# Altium schematic sheet Power.SchDoc
size Letter
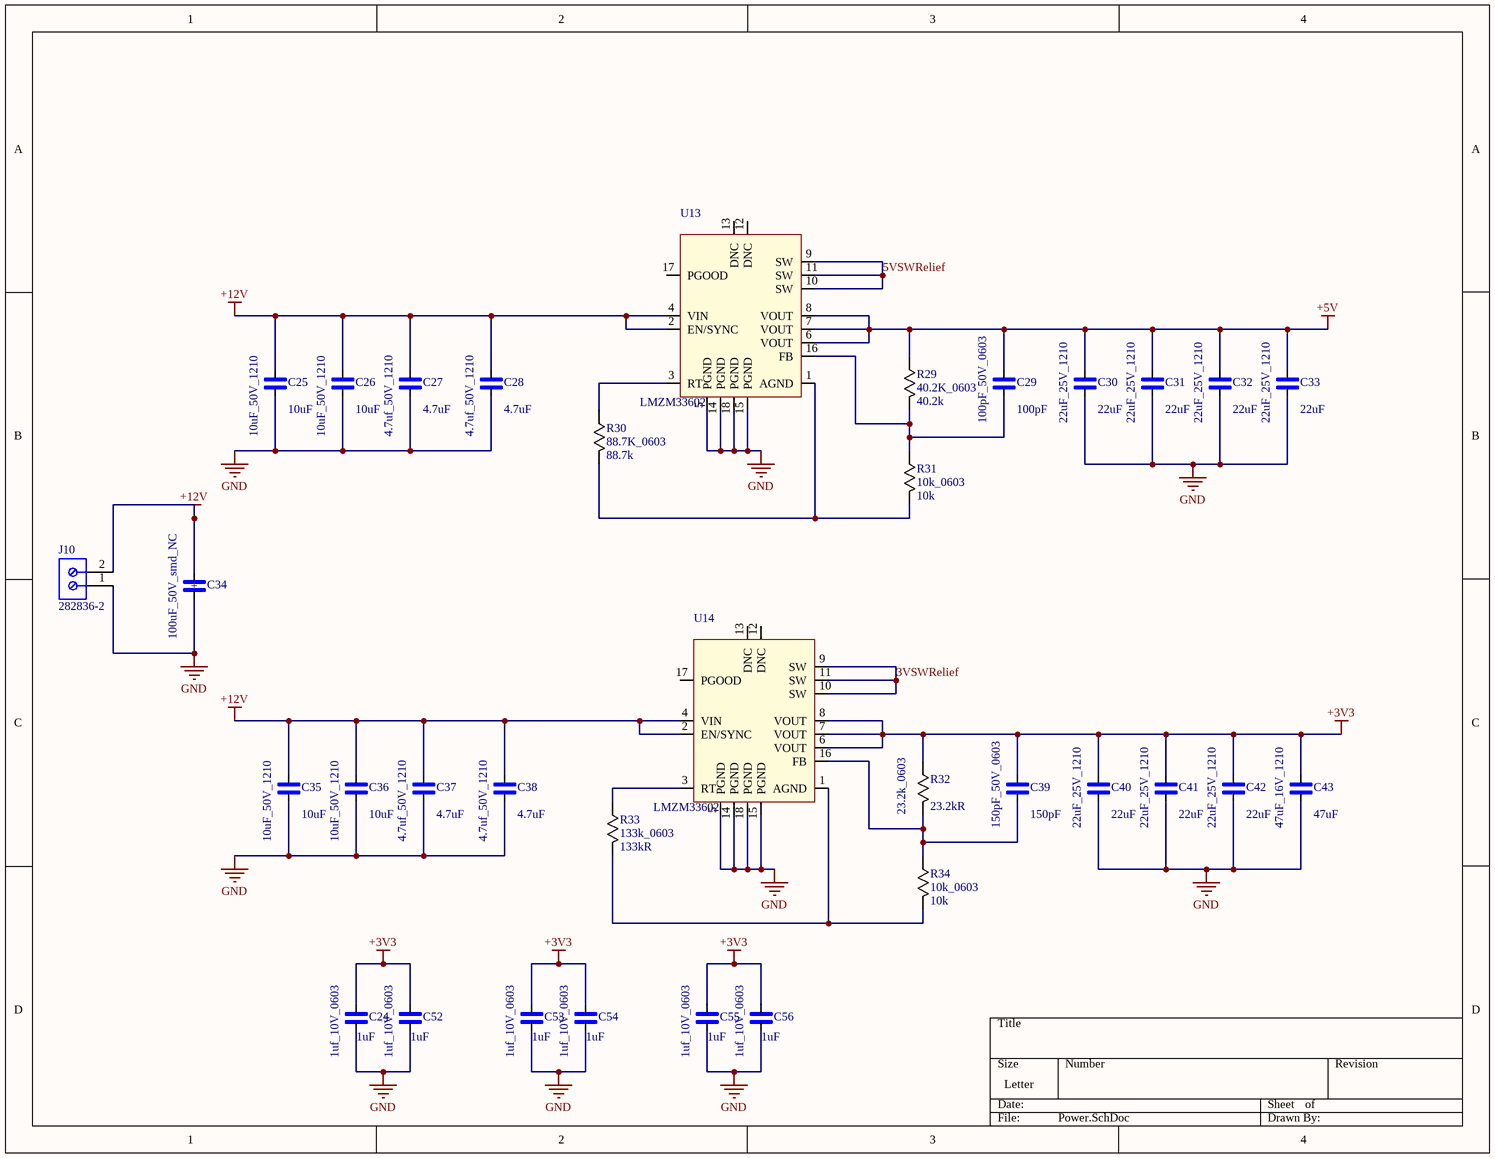
[diagram p0: Power.SchDoc]

## Parts
C24  1uf_10V_0603  Capacitance: 1uF  [0603]
C25  10uF_50V_1210  Capacitance: 10uF  [1210]
C26  10uF_50V_1210  Capacitance: 10uF  [1210]
C27  4.7uf_50V_1210  Capacitance: 4.7uF  [1210]
C28  4.7uf_50V_1210  Capacitance: 4.7uF  [1210]
C29  100pF_50V_0603  Capacitance: 100pF  [0603]
C30  22uF_25V_1210  Capacitance: 22uF  [1210]
C31  22uF_25V_1210  Capacitance: 22uF  [1210]
C32  22uF_25V_1210  Capacitance: 22uF  [1210]
C33  22uF_25V_1210  Capacitance: 22uF  [1210]
C34  100uF_50V_smd_NC  [CAPAE120103X105M]
C35  10uF_50V_1210  Capacitance: 10uF  [1210]
C36  10uF_50V_1210  Capacitance: 10uF  [1210]
C37  4.7uf_50V_1210  Capacitance: 4.7uF  [1210]
C38  4.7uf_50V_1210  Capacitance: 4.7uF  [1210]
C39  150pF_50V_0603  Capacitance: 150pF  [0603]
C40  22uF_25V_1210  Capacitance: 22uF  [1210]
C41  22uF_25V_1210  Capacitance: 22uF  [1210]
C42  22uF_25V_1210  Capacitance: 22uF  [1210]
C43  47uF_16V_1210  Capacitance: 47uF  [1210]
C52  1uf_10V_0603  Capacitance: 1uF  [0603]
C53  1uf_10V_0603  Capacitance: 1uF  [0603]
C54  1uf_10V_0603  Capacitance: 1uF  [0603]
C55  1uf_10V_0603  Capacitance: 1uF  [0603]
C56  1uf_10V_0603  Capacitance: 1uF  [0603]
J10  282836-2  [TECO-282836-2_V]
R29  40.2K_0603  Resistance: 40.2k  [0603]
R30  88.7K_0603  Resistance: 88.7k  [0603]
R31  10k_0603  Resistance: 10k  [0603]
R32  23.2k_0603  Resistance: 23.2kR  [0603]
R33  133k_0603  Resistance: 133kR  [0603]
R34  10k_0603  Resistance: 10k  [0603]
U13  LMZM33602  [QFN50P700X900X410_HS-55N]
U14  LMZM33602  [QFN50P700X900X410_HS-55N]

## Nets
+3V3: C24.2 C39.2 C40.2 C41.2 C42.2 C43.2 C52.2 C53.2 C54.2 C55.2 C56.2 R32.2 U14.6(VOUT) U14.7(VOUT) U14.8(VOUT)
+5V: C29.2 C30.2 C31.2 C32.2 C33.2 R29.2 U13.6(VOUT) U13.7(VOUT) U13.8(VOUT)
+12V: C25.2 C26.2 C27.2 C28.2 C34.1(+) C35.2 C36.2 C37.2 C38.2 J10.2 U13.2(EN/SYNC) U13.4(VIN) U14.2(EN/SYNC) U14.4(VIN)
GND: C24.1 C25.1 C26.1 C27.1 C28.1 C30.1 C31.1 C32.1 C33.1 C34.2 C35.1 C36.1 C37.1 C38.1 C40.1 C41.1 C42.1 C43.1 C52.1 C53.1 C54.1 C55.1 C56.1 J10.1 U13.5(PGND) U13.14(PGND) U13.15(PGND) U13.18(PGND) U14.5(PGND) U14.14(PGND) U14.15(PGND) U14.18(PGND)
3VSWRelief: U14.9(SW) U14.10(SW) U14.11(SW)
5VSWRelief: U13.9(SW) U13.10(SW) U13.11(SW)
NetC29_1: C29.1 R29.1 R31.2 U13.16(FB)
NetC39_1: C39.1 R32.1 R34.2 U14.16(FB)
NetR30_1: R30.1 R31.1 U13.1(AGND)
NetR30_2: R30.2 U13.3(RT)
NetR33_1: R33.1 R34.1 U14.1(AGND)
NetR33_2: R33.2 U14.3(RT)

Not connected (* = marked no-connect by the designer): U13 12(DNC) 13(DNC) 17(PGOOD); U14 12(DNC) 13(DNC) 17(PGOOD)

## Library data of the parts
C24 C52-C56 = 1uf_10V_0603: Manufacturer: Murata; Manufacturer Part Number: GRM188R61A105KA61J; Voltage Rating: 10V; Tolerance: 10%; Dielectric: X5R; Supplier 1: Digi-Key; Stock 1: 0; Pricing 1: 30000=0.0118 (USD); Mount: Surface Mount; Case/Package: 0603; Case Code (Metric): 1608; Case Code (Imperial): 0603; Min Operating Temperature: -55°C; Max Operating Temperature: 85°C; Package Quantity: 1; Packaging: Tape and Reel; Voltage Rating (DC): 10V; Termination: SMD/SMT; Length: 1.6mm; Height: 0.8mm; Width: 0.031inch; Thickness: 0.035inch; Depth: 0.8mm; Radiation Hardening: No; REACH SVHC: No SVHC; ComponentLink1URL: https://datasheet.ciiva.com/6270/product-6270752.pdf; ComponentLink1Description: https://datasheet.ciiva.com/6270/product-6270752.pdf; ComponentLink2URL: https://datasheet.ciiva.com/6270/partnumbering-e-01-6270748.pdf; ComponentLink2Description: https://datasheet.ciiva.com/6270/partnumbering-e-01-6270748.pdf; ComponentLink3URL: https://datasheet.ciiva.com/6270/partnumbering-e-01-6270750.pdf; ComponentLink3Description: https://datasheet.ciiva.com/6270/partnumbering-e-01-6270750.pdf; Supplier Part Number 1: GRM188R61A105KA61J-ND
C25 C26 C35 C36 = 10uF_50V_1210: Manufacturer: Murata; Manufacturer Part Number: GRM32ER71H106KA12L; Material: Ceramic; Tolerance: 10%; Dielectric: X7R; Voltage Rating (DC): 50V; Supplier 1: Digi-Key; Stock 1: 0; Mount: Surface Mount; Case/Package: 1210; Case Code (Imperial): 1210; Case Code (Metric): 3225; Min Operating Temperature: -55°C; Max Operating Temperature: 125°C; Package Quantity: 1000; Packaging: Tape and Reel; Voltage Rating: 50V; Termination: SMD/SMT; Voltage: 50V; Length: 3.2mm; Height: 2.5mm; Width: 2.5mm; Thickness: 0.106inch; Depth: 2.5mm; Radiation Hardening: No; REACH SVHC: No SVHC; Lead Free: Lead Free; ComponentLink1URL: https://datasheet.ciiva.com/16497/product-16497010.pdf; ComponentLink1Description: https://datasheet.ciiva.com/16497/product-16497010.pdf; ComponentLink2URL: https://datasheet.ciiva.com/6270/partnumbering-e-01-6270167.pdf; ComponentLink2Description: https://datasheet.ciiva.com/6270/partnumbering-e-01-6270167.pdf; ComponentLink3URL: https://datasheet.ciiva.com/6270/partnumbering-e-01-6270168.pdf; ComponentLink3Description: https://datasheet.ciiva.com/6270/partnumbering-e-01-6270168.pdf; ComponentLink4URL: https://datasheet.ciiva.com/6270/partnumbering-e-01-6270169.pdf; ComponentLink4Description: https://datasheet.ciiva.com/6270/partnumbering-e-01-6270169.pdf; ComponentLink5URL: https://datasheet.ciiva.com/11789/0900766b80ef921d-11789081.pdf; ComponentLink5Description: https://datasheet.ciiva.com/11789/0900766b80ef921d-11789081.pdf; ComponentLink6URL: https://datasheet.ciiva.com/3777/4286grm32er71h106ka1223-3777306.pdf; ComponentLink6Description: https://datasheet.ciiva.com/3777/4286grm32er71h106ka1223-3777306.pdf; ComponentLink7URL: https://datasheet.ciiva.com/11607/c02e-11607596.pdf; ComponentLink7Description: https://datasheet.ciiva.com/11607/c02e-11607596.pdf; ComponentLink8URL: https://datasheet.ciiva.com/46441/1754714-46441340.pdf; ComponentLink8Description: https://datasheet.ciiva.com/46441/1754714-46441340.pdf; ComponentLink9URL: https://datasheet.ciiva.com/2989/c02e-2989823.pdf; ComponentLink9Description: https://datasheet.ciiva.com/2989/c02e-2989823.pdf; Supplier Part Number 1: GRM32ER71H106KA12L-ND
C27 C28 C37 C38 = 4.7uf_50V_1210: Manufacturer: Murata; Manufacturer Part Number: GRM32ER71H475KA88L; Tolerance: 10%; Dielectric: X7R; Voltage Rating: 50V; Supplier 1: Future Electronics; Stock 1: 0; Mount: Surface Mount; Case/Package: 1210; Number of Pins: 2; Case Code (Metric): 3225; Case Code (Imperial): 1210; Min Operating Temperature: -55°C; Max Operating Temperature: 125°C; Packaging: Tape and Reel; Package Quantity: 1; Voltage Rating (DC): 50V; Termination: SMD/SMT; Voltage: 50V; Length: 3.2mm; Height: 2.5mm; Width: 0.098inch; Thickness: 0.106inch; Depth: 2.5mm; Radiation Hardening: No; REACH SVHC: No SVHC; Lead Free: Lead Free; ComponentLink1URL: https://datasheet.ciiva.com/7937/1747494-7937780.pdf; ComponentLink1Description: https://datasheet.ciiva.com/7937/1747494-7937780.pdf; ComponentLink2URL: https://datasheet.ciiva.com/11786/0900766b806042af-11786805.pdf; ComponentLink2Description: https://datasheet.ciiva.com/11786/0900766b806042af-11786805.pdf; ComponentLink3URL: https://datasheet.ciiva.com/22703/1747494-22703399.pdf; ComponentLink3Description: https://datasheet.ciiva.com/22703/1747494-22703399.pdf; ComponentLink4URL: https://datasheet.ciiva.com/48436/grm32er71h475ka88l-eng-tds-48436715.pdf; ComponentLink4Description: https://datasheet.ciiva.com/48436/grm32er71h475ka88l-eng-tds-48436715.pdf; ComponentLink5URL: https://datasheet.ciiva.com/18101/getdatasheetpartid-55823-18101548.pdf; ComponentLink5Description: https://datasheet.ciiva.com/18101/getdatasheetpartid-55823-18101548.pdf; ComponentLink6URL: https://datasheet.ciiva.com/142/partnumbering-e-01-142157.pdf; ComponentLink6Description: https://datasheet.ciiva.com/142/partnumbering-e-01-142157.pdf; ComponentLink7URL: https://datasheet.ciiva.com/142/partnumbering-e-01-142158.pdf; ComponentLink7Description: https://datasheet.ciiva.com/142/partnumbering-e-01-142158.pdf; ComponentLink8URL: https://datasheet.ciiva.com/142/partnumbering-e-01-142159.pdf; ComponentLink8Description: https://datasheet.ciiva.com/142/partnumbering-e-01-142159.pdf; ComponentLink9URL: https://datasheet.ciiva.com/16199/product-16199503.pdf; ComponentLink9Description: https://datasheet.ciiva.com/16199/product-16199503.pdf; Supplier Part Number 1: GRM32ER71H475KA88L
C29 = 100pF_50V_0603: Manufacturer: Murata; Manufacturer Part Number: GRM1885C1H101JA01D; Dielectric Material: Ceramic; Voltage Rating: 50V; Tolerance: 5%; Dielectric: C0G; Temperature Coefficient: 30ppm/°C; Insulation Resistance: 10GR; Supplier 1: Digi-Key; Stock 1: 0; Pricing 1: 4000=0.01524 (USD); Mount: Surface Mount; Case/Package: 0603; Number of Pins: 2; Weight: 7.1E-05oz; Case Code (Metric): 1608; Case Code (Imperial): 0603; Material: Ceramic; Min Operating Temperature: -55°C; Max Operating Temperature: 125°C; Packaging: Tape and Reel; Package Quantity: 1; Voltage Rating (DC): 50V; Termination: SMD/SMT; Voltage: 50V; Length: 1.6mm; Height: 0.8mm; Width: 0.031inch; Thickness: 0.035inch; Depth: 0.8mm; Radiation Hardening: No; REACH SVHC: Unknown; Lead Free: Lead Free; ComponentLink1URL: https://datasheet.ciiva.com/131/product-131088.pdf; ComponentLink1Description: https://datasheet.ciiva.com/131/product-131088.pdf; ComponentLink2URL: https://datasheet.ciiva.com/3777/grm1885c1h101ja0123-3777264.pdf; ComponentLink2Description: https://datasheet.ciiva.com/3777/grm1885c1h101ja0123-3777264.pdf; ComponentLink3URL: https://datasheet.ciiva.com/131/partnumbering-e-01-131089.pdf; ComponentLink3Description: https://datasheet.ciiva.com/131/partnumbering-e-01-131089.pdf; ComponentLink4URL: https://datasheet.ciiva.com/18100/getdatasheetpartid-26823-18100641.pdf; ComponentLink4Description: https://datasheet.ciiva.com/18100/getdatasheetpartid-26823-18100641.pdf; ComponentLink5URL: https://datasheet.ciiva.com/11605/c02e-11605557.pdf; ComponentLink5Description: https://datasheet.ciiva.com/11605/c02e-11605557.pdf; ComponentLink6URL: https://datasheet.ciiva.com/28556/4360-28556551.pdf; ComponentLink6Description: https://datasheet.ciiva.com/28556/4360-28556551.pdf; ComponentLink7URL: https://datasheet.ciiva.com/7828/4360-7828889.pdf; ComponentLink7Description: https://datasheet.ciiva.com/7828/4360-7828889.pdf; ComponentLink8URL: https://datasheet.ciiva.com/7828/4360-7828890.pdf; ComponentLink8Description: https://datasheet.ciiva.com/7828/4360-7828890.pdf; ComponentLink9URL: https://datasheet.ciiva.com/7828/4360-7828891.pdf; ComponentLink9Description: https://datasheet.ciiva.com/7828/4360-7828891.pdf; ComponentLink10URL: https://datasheet.ciiva.com/14116/grmseries-tc-hitype-eng-14116828.pdf; ComponentLink10Description: https://datasheet.ciiva.com/14116/grmseries-tc-hitype-eng-14116828.pdf; ComponentLink11URL: https://datasheet.ciiva.com/16291/product-16291613.pdf; ComponentLink11Description: https://datasheet.ciiva.com/16291/product-16291613.pdf; ComponentLink12URL: https://datasheet.ciiva.com/131/partnumbering-e-01-131087.pdf; ComponentLink12Description: https://datasheet.ciiva.com/131/partnumbering-e-01-131087.pdf; ComponentLink13URL: https://datasheet.ciiva.com/14116/grmseries-tc-hitype-eng-14116815.pdf; ComponentLink13Description: https://datasheet.ciiva.com/14116/grmseries-tc-hitype-eng-14116815.pdf; ComponentLink14URL: https://datasheet.ciiva.com/29149/450134-da-01-en-vs-kondensator-0603-29149008.pdf; ComponentLink14Description: https://datasheet.ciiva.com/29149/450134-da-01-en-vs-kondensator-0603-29149008.pdf; Supplier Part Number 1: 490-1427-2-ND
C30-C33 C40-C42 = 22uF_25V_1210: Manufacturer: Murata; Manufacturer Part Number: GRM32ER71E226KE15L; Material: Ceramic; Tolerance: 10%; Dielectric: X7R; Voltage Rating: 25V; Supplier 1: Digi-Key; Stock 1: 0; Pricing 1: 1000=0.29 (USD); Mount: Surface Mount; Case/Package: 1210; Number of Pins: 2; Case Code (Metric): 3225; Case Code (Imperial): 1210; Min Operating Temperature: -55°C; Max Operating Temperature: 125°C; Packaging: Tape and Reel; Package Quantity: 1; Voltage Rating (DC): 25V; Termination: SMD/SMT; Voltage: 25V; Length: 3.2mm; Height: 2.5mm; Width: 0.098inch; Thickness: 0.106inch; Depth: 2.5mm; Radiation Hardening: No; REACH SVHC: No SVHC; Lead Free: Lead Free; ComponentLink1URL: https://datasheet.ciiva.com/6072/1697714-6072768.pdf; ComponentLink1Description: https://datasheet.ciiva.com/6072/1697714-6072768.pdf; ComponentLink2URL: https://datasheet.ciiva.com/16497/product-16497009.pdf; ComponentLink2Description: https://datasheet.ciiva.com/16497/product-16497009.pdf; ComponentLink3URL: https://datasheet.ciiva.com/175/partnumbering-e-01-175746.pdf; ComponentLink3Description: https://datasheet.ciiva.com/175/partnumbering-e-01-175746.pdf; ComponentLink4URL: https://datasheet.ciiva.com/175/partnumbering-e-01-175747.pdf; ComponentLink4Description: https://datasheet.ciiva.com/175/partnumbering-e-01-175747.pdf; ComponentLink5URL: https://datasheet.ciiva.com/175/partnumbering-e-01-175748.pdf; ComponentLink5Description: https://datasheet.ciiva.com/175/partnumbering-e-01-175748.pdf; ComponentLink6URL: https://datasheet.ciiva.com/3776/2741grm32er71e226ke1523-3776996.pdf; ComponentLink6Description: https://datasheet.ciiva.com/3776/2741grm32er71e226ke1523-3776996.pdf; ComponentLink7URL: https://datasheet.ciiva.com/22703/1697714-22703397.pdf; ComponentLink7Description: https://datasheet.ciiva.com/22703/1697714-22703397.pdf; ComponentLink8URL: https://datasheet.ciiva.com/11789/0900766b80ef921d-11789129.pdf; ComponentLink8Description: https://datasheet.ciiva.com/11789/0900766b80ef921d-11789129.pdf; ComponentLink9URL: https://datasheet.ciiva.com/29201/451826-da-01-de-vs-kondens-grm32-er71e-226ke15l-29201795.pdf; ComponentLink9Description: https://datasheet.ciiva.com/29201/451826-da-01-de-vs-kondens-grm32-er71e-226ke15l-29201795.pdf; Supplier Part Number 1: 490-5313-2-ND
C34 = 100uF_50V_smd_NC: Manufacturer: Panasonic; Manufacturer Part Number: EEH-ZA1H101P; Material: Polymer; Tolerance: 20%; ESR (Equivalent Series Resistance): 28mR; Ripple Current: 2A; Voltage Rating: 50V; Polarity: Polar; Life (Hours): 10000Hour; Leakage Current: 50uA; Lead Diameter: 0.9mm; Capacitance: 100uF; Supplier 1: Digi-Key; Stock 1: 21500; Pricing 1: 500=1.20086, 1000=1.05076, 2500=1.01323, 5000=0.9757 (USD); Mount: Surface Mount,PCB; Case/Package: Radial; Min Operating Temperature: -55°C; Max Operating Temperature: 105°C; Packaging: Tape and Reel; Ripple Current (AC): 2A; Voltage Rating (DC): 50V; Package Quantity: 500; Termination: SMD/SMT; Voltage: 50V; Diameter: 10mm; Length: 10.2mm; Height: 10.2mm; Lead Pitch: 4.6mm; Height - Seated (Max): 0.413inch; Radiation Hardening: No; REACH SVHC: No SVHC; Lead Free: Lead Free; ComponentLink1URL: https://datasheet.ciiva.com/48541/eehza-eng-tds-48541031.pdf; ComponentLink1Description: https://datasheet.ciiva.com/48541/eehza-eng-tds-48541031.pdf; ComponentLink2URL: https://datasheet.ciiva.com/18524/aba0000ce136-18524922.pdf; ComponentLink2Description: https://datasheet.ciiva.com/18524/aba0000ce136-18524922.pdf; ComponentLink3URL: https://datasheet.ciiva.com/6134/1536543-6134363.pdf; ComponentLink3Description: https://datasheet.ciiva.com/6134/1536543-6134363.pdf; ComponentLink4URL: https://datasheet.ciiva.com/7794/1536543-7794235.pdf; ComponentLink4Description: https://datasheet.ciiva.com/7794/1536543-7794235.pdf; ComponentLink5URL: https://datasheet.ciiva.com/18524/aba0000ce136-18524923.pdf; ComponentLink5Description: https://datasheet.ciiva.com/18524/aba0000ce136-18524923.pdf; ComponentLink6URL: https://datasheet.ciiva.com/30178/86aba0000ce136-30178699.pdf; ComponentLink6Description: https://datasheet.ciiva.com/30178/86aba0000ce136-30178699.pdf; ComponentLink7URL: https://datasheet.ciiva.com/14595/70256916-14595260.pdf; ComponentLink7Description: https://datasheet.ciiva.com/14595/70256916-14595260.pdf; ComponentLink8URL: https://datasheet.ciiva.com/18524/aba0000ce136-18524924.pdf; ComponentLink8Description: https://datasheet.ciiva.com/18524/aba0000ce136-18524924.pdf; ComponentLink9URL: https://datasheet.ciiva.com/28691/1536543-28691421.pdf; ComponentLink9Description: https://datasheet.ciiva.com/28691/1536543-28691421.pdf; ComponentLink10URL: https://datasheet.ciiva.com/22730/1536543-22730558.pdf; ComponentLink10Description: https://datasheet.ciiva.com/22730/1536543-22730558.pdf; ComponentLink11URL: https://datasheet.ciiva.com/10327/aba0000ce136-10327231.pdf; ComponentLink11Description: https://datasheet.ciiva.com/10327/aba0000ce136-10327231.pdf; Supplier Part Number 1: P15442TR-ND
C39 = 150pF_50V_0603: Manufacturer: Murata; Manufacturer Part Number: GRM1885C1H151JA01D; Dielectric Material: Ceramic; Tolerance: 5%; Voltage Rating: 50V; Dielectric: C0G; Temperature Coefficient: 30ppm/°C; Insulation Resistance: 10GR; Supplier 1: Digi-Key; Stock 1: 0; Pricing 1: 4000=0.01668 (USD); Mount: Surface Mount; Case/Package: 0603; Number of Pins: 2; Case Code (Imperial): 0603; Case Code (Metric): 1608; Material: Ceramic; Min Operating Temperature: -55°C; Max Operating Temperature: 125°C; Packaging: Tape and Reel; Voltage Rating (DC): 50V; Package Quantity: 1; Termination: SMD/SMT; Voltage: 50V; Length: 1.6mm; Height: 0.8mm; Width: 0.8mm; Thickness: 0.035inch; Depth: 0.8mm; Radiation Hardening: No; REACH SVHC: No SVHC; Lead Free: Lead Free; ComponentLink1URL: https://datasheet.ciiva.com/18100/getdatasheetpartid-31970-18100850.pdf; ComponentLink1Description: https://datasheet.ciiva.com/18100/getdatasheetpartid-31970-18100850.pdf; ComponentLink2URL: https://datasheet.ciiva.com/7828/4360-7828901.pdf; ComponentLink2Description: https://datasheet.ciiva.com/7828/4360-7828901.pdf; ComponentLink3URL: https://datasheet.ciiva.com/7828/4360-7828902.pdf; ComponentLink3Description: https://datasheet.ciiva.com/7828/4360-7828902.pdf; ComponentLink4URL: https://datasheet.ciiva.com/131/partnumbering-e-01-131975.pdf; ComponentLink4Description: https://datasheet.ciiva.com/131/partnumbering-e-01-131975.pdf; ComponentLink5URL: https://datasheet.ciiva.com/131/partnumbering-e-01-131976.pdf; ComponentLink5Description: https://datasheet.ciiva.com/131/partnumbering-e-01-131976.pdf; ComponentLink6URL: https://datasheet.ciiva.com/131/partnumbering-e-01-131977.pdf; ComponentLink6Description: https://datasheet.ciiva.com/131/partnumbering-e-01-131977.pdf; ComponentLink7URL: https://datasheet.ciiva.com/16214/product-16214654.pdf; ComponentLink7Description: https://datasheet.ciiva.com/16214/product-16214654.pdf; ComponentLink8URL: https://datasheet.ciiva.com/11787/0900766b808736db-11787103.pdf; ComponentLink8Description: https://datasheet.ciiva.com/11787/0900766b808736db-11787103.pdf; ComponentLink9URL: https://datasheet.ciiva.com/29241/450401-da-01-en-vs-kondensator-0603-29241818.pdf; ComponentLink9Description: https://datasheet.ciiva.com/29241/450401-da-01-en-vs-kondensator-0603-29241818.pdf; Supplier Part Number 1: 490-1431-2-ND
C43 = 47uF_16V_1210: Manufacturer: Murata; Manufacturer Part Number: GRM32ER61C476KE15L; Material: Ceramic; Tolerance: 10%; Dielectric: X5R; Voltage Rating: 16V; Supplier 1: Digi-Key; Stock 1: 0; Mount: Surface Mount; Case/Package: 1210; Number of Pins: 2; Case Code (Metric): 3225; Case Code (Imperial): 1210; Min Operating Temperature: -55°C; Max Operating Temperature: 85°C; Voltage Rating (DC): 16V; Packaging: Cut Tape; Package Quantity: 1; Termination: SMD/SMT; Voltage: 16V; Length: 3.2mm; Height: 2.5mm; Width: 0.098inch; Thickness: 0.106inch; Depth: 2.5mm; Radiation Hardening: No; REACH SVHC: No SVHC; Lead Free: Lead Free; ComponentLink1URL: https://datasheet.ciiva.com/5411/product-5411296.pdf; ComponentLink1Description: https://datasheet.ciiva.com/5411/product-5411296.pdf; ComponentLink2URL: https://datasheet.ciiva.com/6264/c02e-6264496.pdf; ComponentLink2Description: https://datasheet.ciiva.com/6264/c02e-6264496.pdf; ComponentLink3URL: https://datasheet.ciiva.com/16497/product-16497029.pdf; ComponentLink3Description: https://datasheet.ciiva.com/16497/product-16497029.pdf; ComponentLink4URL: https://datasheet.ciiva.com/16625/product-16625285.pdf; ComponentLink4Description: https://datasheet.ciiva.com/16625/product-16625285.pdf; ComponentLink5URL: https://datasheet.ciiva.com/6173/1747491-6173112.pdf; ComponentLink5Description: https://datasheet.ciiva.com/6173/1747491-6173112.pdf; ComponentLink6URL: https://datasheet.ciiva.com/6264/partnumbering-e-01-6264495.pdf; ComponentLink6Description: https://datasheet.ciiva.com/6264/partnumbering-e-01-6264495.pdf; ComponentLink7URL: https://datasheet.ciiva.com/29202/451184-da-01-de-vs-chip-kond-1210-47-0-uf-10pr-16-0v-x5r-29202483.pdf; ComponentLink7Description: https://datasheet.ciiva.com/29202/451184-da-01-de-vs-chip-kond-1210-47-0-uf-10pr-16-0v-x5r-29202483.pdf; ComponentLink8URL: https://datasheet.ciiva.com/29201/451871-da-01-de-vs-kondens-grm32-er61c-476ke15l-29201820.pdf; ComponentLink8Description: https://datasheet.ciiva.com/29201/451871-da-01-de-vs-kondens-grm32-er61c-476ke15l-29201820.pdf; Supplier Part Number 1: GRM32ER61C476KE15L-ND
J10 = 282836-2: Female Header, Pitch 5 mm, 1 x 2 Position, Height 10 mm, Tail Length 3.5 mm, Rohs, Bulk; Current: 13.5A; Clamp Material - Plating: Brass - Nickel Plated; Dynamic Catalog: Buchanan Series; Positions Per Level: 2; Wire Termination: Screw - Rising Cage Clamp; Other Names: 5ULV-02B / A98076; Screw Thread: M3; Number of Levels: 1; Wire Gauge: 16-30 AWG; Product Training Modules: Wire-to-Board Eurostyle Terminal Blocks; Mating Orientation: Horizontal with Board; 3D Model: 282836-2.pdf; Featured Product: Eurostyle Terminal Block Connectors; Pitch: 0.197" (5.00mm); Voltage: 300V; Torque - Screw: 0.68 Nm (6 Lb-In); PackageReference: THD; PackageDescription: Female Header, Pitch 5 mm, 1 x 2 Position, Height 10 mm, Tail Length 3.5 mm; Supplier 1: Newark; Supplier Part Number 1: 23C9697; Supplier 2: Farnell; Supplier Part Number 2: 3089034; Supplier 3: Digi-Key; Supplier Part Number 3: A98076-ND; Features: Interlocking (Side); Color: Green; Packaging: Bulk; Family: Terminal Blocks - Wire to Board; Housing Material: Polyamide (PA66), Nylon 6/6; RoHS Information: 282836-2 Statement of Compliance; Mounting Type: Through Hole; Series: Buchanan; Standard Package: 300; Contact Material - Plating: Brass - Tin Plated; Category: Connectors, Interconnects; Screw Material - Plating: Brass - Nickel Plated; ComponentLink1Description: Manufacturer URL; ComponentLink1URL: http://www.te.com; ComponentLink2Description: Datasheet; ComponentLink2URL: http://www.te.com.cn/commerce/DocumentDelivery/DDEController?Action=showdoc&DocId=Catalog+Section%7F1308389_EUROSTYLE_TERMINAL_BLOCKS%7F0607%7Fpdf%7FEnglish%7FENG_CS_1308389_EUROSTYLE_TERMINAL_BLOCKS_0607.pdf%7F282836-2
R29 = 40.2K_0603: Manufacturer: Vishay Dale; Manufacturer Part Number: M55342E12B40B2RWS; Tolerance: 0.1%; Temperature Coefficient: 25ppm/°C; Max Power Dissipation: 100mW; ComponentLink1URL: https://datasheet.ciiva.com/16884/crcwhpe3-16884389.pdf; ComponentLink1Description: https://datasheet.ciiva.com/16884/crcwhpe3-16884389.pdf; ComponentLink2URL: https://datasheet.ciiva.com/9010/crcwhpe3-9010219.pdf; ComponentLink2Description: https://datasheet.ciiva.com/9010/crcwhpe3-9010219.pdf; ComponentLink3URL: https://datasheet.ciiva.com/2527/crcwhpe3-2527276.pdf; ComponentLink3Description: https://datasheet.ciiva.com/2527/crcwhpe3-2527276.pdf; ComponentLink4URL: https://datasheet.ciiva.com/2527/crcwhpe3-2527277.pdf; ComponentLink4Description: https://datasheet.ciiva.com/2527/crcwhpe3-2527277.pdf; ComponentLink5URL: https://datasheet.ciiva.com/2527/crcwhpe3-2527278.pdf; ComponentLink5Description: https://datasheet.ciiva.com/2527/crcwhpe3-2527278.pdf; Supplier 1: Digi-Key; Stock 1: 0; Case/Package: 0603; Case Code (Metric): 1608; Case Code (Imperial): 0603; Min Operating Temperature: -55°C; Max Operating Temperature: 150°C; Packaging: Tray; Package Quantity: 1; Composition: Thin Film; Number of Terminations: 2; Failure Rate: 0.01%; Length: 0.064inch; Height: 0.033inch; Width: 0.032inch; ComponentLink6URL: http://www.vishay.com/docs/60018/eh.pdf; ComponentLink6Description: http://www.vishay.com/docs/60018/eh.pdf; Supplier Part Number 1: M55342E12B40B2RWS-MIL
R30 = 88.7K_0603: Manufacturer: TE Connectivity; Manufacturer Part Number: 8-2176089-5; Tolerance: 0.1%; Max Power Dissipation: 167mW; Temperature Coefficient: 25ppm/°C; Supplier 1: Digi-Key; Stock 1: 0; Pricing 1: 1000=0.14518, 2000=0.1432 (USD); Case/Package: 0603; Case Code (Metric): 1608; Case Code (Imperial): 0603; Min Operating Temperature: -55°C; Max Operating Temperature: 155°C; Packaging: Tape and Reel; Composition: Thin Film; Number of Terminations: 2; Package Quantity: 1; Length: 0.061inch; Height: 0.022inch; Width: 0.031inch; ComponentLink1URL: https://datasheet.ciiva.com/41810/eng-ds-1773272-j-41810143.pdf; ComponentLink1Description: https://datasheet.ciiva.com/41810/eng-ds-1773272-j-41810143.pdf; ComponentLink2URL: https://datasheet.ciiva.com/41821/eng-ds-1773272-j-41821583.pdf; ComponentLink2Description: https://datasheet.ciiva.com/41821/eng-ds-1773272-j-41821583.pdf; Supplier Part Number 1: A110295TR-ND
R31 R34 = 10k_0603: Manufacturer: Panasonic; Manufacturer Part Number: ERJ-3EKF1002V; Tolerance: 1%; Max Power Dissipation: 100mW; Temperature Coefficient: 100ppm/°C; Voltage Rating: 75V; Supplier 1: Digi-Key; Stock 1: 0; Pricing 1: 5000=0.00751, 10000=0.00653, 25000=0.00573, 50000=0.00526, 125000=0.00515 (USD); Mount: Surface Mount; Case/Package: 0603; Number of Pins: 2; Case Code (Metric): 1608; Case Code (Imperial): 0603; Contact Plating: Tin; Min Operating Temperature: -55°C; Max Operating Temperature: 155°C; Packaging: Tape and Reel; Power Rating: 100mW; Package Quantity: 1; Termination: SMD/SMT; Composition: Thick Film; Number of Terminations: 2; Military Standard: Not; Voltage Rating (DC): 75V; Length: 1.6mm; Height: 0.45mm; Depth: 0.8mm; Width: 0.031inch; Radiation Hardening: No; Lead Free: Lead Free; REACH SVHC: No SVHC; ComponentLink1URL: https://datasheet.ciiva.com/16511/aoa0000ce2-16511861.pdf; ComponentLink1Description: https://datasheet.ciiva.com/16511/aoa0000ce2-16511861.pdf; ComponentLink2URL: https://datasheet.ciiva.com/46372/1678782-46372725.pdf; ComponentLink2Description: https://datasheet.ciiva.com/46372/1678782-46372725.pdf; ComponentLink3URL: https://datasheet.ciiva.com/28514/426256-28514198.pdf; ComponentLink3Description: https://datasheet.ciiva.com/28514/426256-28514198.pdf; ComponentLink4URL: https://datasheet.ciiva.com/9194/aoa0000ce2-9194199.pdf; ComponentLink4Description: https://datasheet.ciiva.com/9194/aoa0000ce2-9194199.pdf; ComponentLink5URL: https://datasheet.ciiva.com/7830/aoa0000ce2-7830729.pdf; ComponentLink5Description: https://datasheet.ciiva.com/7830/aoa0000ce2-7830729.pdf; ComponentLink6URL: https://datasheet.ciiva.com/17212/aoa0000ce2-17212105.pdf; ComponentLink6Description: https://datasheet.ciiva.com/17212/aoa0000ce2-17212105.pdf; ComponentLink7URL: https://datasheet.ciiva.com/30208/aoa0000ce2-30208985.pdf; ComponentLink7Description: https://datasheet.ciiva.com/30208/aoa0000ce2-30208985.pdf; ComponentLink8URL: https://datasheet.ciiva.com/48530/aoa0000ce2-48530988.pdf; ComponentLink8Description: https://datasheet.ciiva.com/48530/aoa0000ce2-48530988.pdf; ComponentLink9URL: https://datasheet.ciiva.com/24070/aoa0000ce2-24070318.pdf; ComponentLink9Description: https://datasheet.ciiva.com/24070/aoa0000ce2-24070318.pdf; ComponentLink10URL: https://datasheet.ciiva.com/16759/70260748-16759807.pdf; ComponentLink10Description: https://datasheet.ciiva.com/16759/70260748-16759807.pdf; Supplier Part Number 1: P10.0KHTR-ND
R32 = 23.2k_0603: Manufacturer: TE Connectivity; Manufacturer Part Number: 3-2176089-1; Tolerance: 0.1%; Temperature Coefficient: 25ppm/°C; Max Power Dissipation: 167mW; Power Rating: 166mW; Voltage Rating (DC): 100V; Supplier 1: Digi-Key; Stock 1: 1000; Pricing 1: 1000=0.14518, 2000=0.1432 (USD); Mount: Surface Mount; Case/Package: 0603; Case Code (Metric): 1608; Case Code (Imperial): 0603; Min Operating Temperature: -55°C; Max Operating Temperature: 155°C; Packaging: Cut Tape; Composition: Thin Film; Number of Terminations: 2; Package Quantity: 1000; Voltage Rating: 100V; Length: 0.061inch; Height: 0.022inch; Width: 0.031inch; REACH SVHC: No SVHC; ComponentLink1URL: https://datasheet.ciiva.com/41825/eng-ds-1773272-j-41825125.pdf; ComponentLink1Description: https://datasheet.ciiva.com/41825/eng-ds-1773272-j-41825125.pdf; ComponentLink2URL: https://datasheet.ciiva.com/41807/eng-ds-1773272-j-41807015.pdf; ComponentLink2Description: https://datasheet.ciiva.com/41807/eng-ds-1773272-j-41807015.pdf; ComponentLink3URL: https://datasheet.ciiva.com/41818/eng-ds-1773272-j-41818073.pdf; ComponentLink3Description: https://datasheet.ciiva.com/41818/eng-ds-1773272-j-41818073.pdf; Supplier Part Number 1: A110239TR-ND
R33 = 133k_0603: Manufacturer: TE Connectivity; Manufacturer Part Number: 2176090-2; Tolerance: 0.1%; Temperature Coefficient: 25ppm/°C; Max Power Dissipation: 167mW; Supplier 1: Digi-Key; Stock 1: 0; Pricing 1: 1000=0.14518, 2000=0.1432 (USD); Case/Package: 0603; Case Code (Metric): 1608; Case Code (Imperial): 0603; Min Operating Temperature: -55°C; Max Operating Temperature: 155°C; Packaging: Tape and Reel; Package Quantity: 1000; Composition: Thin Film; Number of Terminations: 2; Military Standard: Not; Length: 0.061inch; Height: 0.022inch; Width: 0.031inch; Depth: 0.8mm; ComponentLink1URL: https://datasheet.ciiva.com/41823/eng-ds-1773272-j-41823608.pdf; ComponentLink1Description: https://datasheet.ciiva.com/41823/eng-ds-1773272-j-41823608.pdf; ComponentLink2URL: https://datasheet.ciiva.com/41810/eng-ds-1773272-j-41810377.pdf; ComponentLink2Description: https://datasheet.ciiva.com/41810/eng-ds-1773272-j-41810377.pdf; ComponentLink3URL: https://datasheet.ciiva.com/41824/eng-ds-1773272-j-41824430.pdf; ComponentLink3Description: https://datasheet.ciiva.com/41824/eng-ds-1773272-j-41824430.pdf; Supplier Part Number 1: A110312TR-ND
U13 U14 = LMZM33602: 4V to 36V, 2A Step-Down DC/DC Power Module